# Altium project Power_Management_Unit.PrjPcb
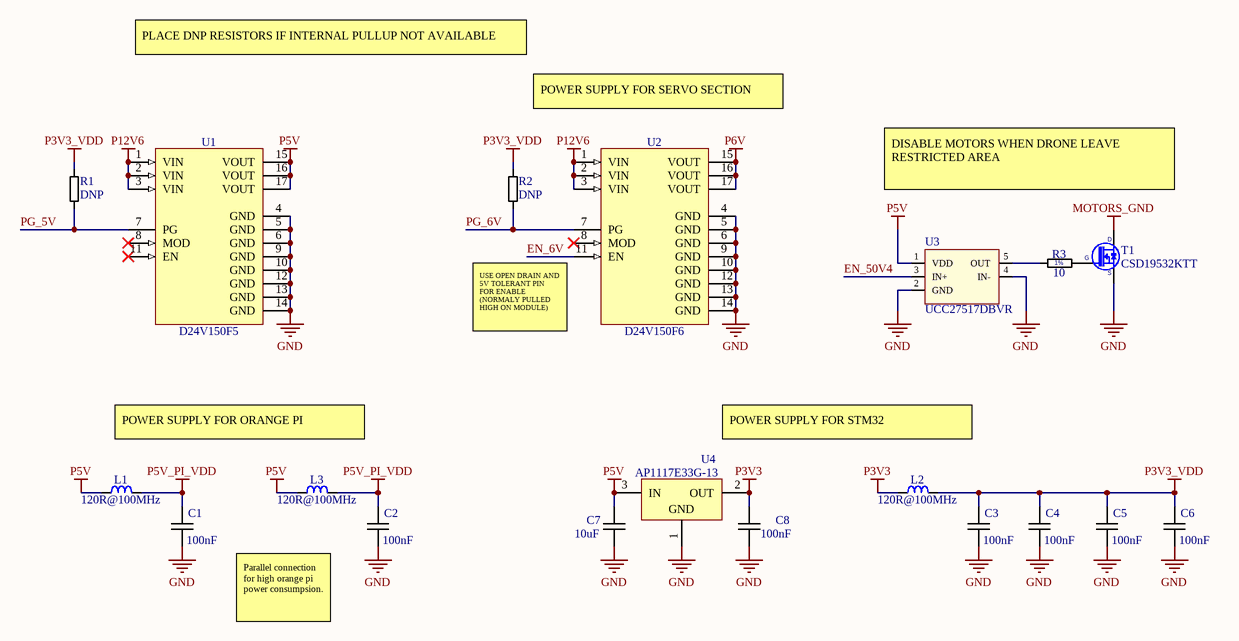
[diagram p0: Power.SchDoc]
5 sheets, 81 parts. Net scope: global (net labels, ports and power ports of the same name join across sheets).
Board file: PMU_v1.0.PcbDoc
Sheets:
  Power.SchDoc
  MCU.SchDoc
  Sensing.SchDoc
  Connectors.SchDoc
  Mechanical.SchDoc

## Sheet Power.SchDoc
size A4; CompanyName: TechOcean Sp. z o. o.; Address1: 02-639 Warszawa; Address2: Domaniewska 37A/119; Revision: 1.0; SheetNumber: 1; SheetTotal: 5

### Parts
C1  100nF  [CAPC0603X90N]
C2  100nF  [CAPC0603X90N]
C3  100nF  [CAPC0603X90N]
C4  100nF  [CAPC0603X90N]
C5  100nF  [CAPC0603X90N]
C6  100nF  [CAPC0603X90N]
C7  10uF  [CAPC0603X90N]
C8  100nF  [CAPC0603X90N]
L1  120R@100MHz  [INDC0603X90N]
L2  120R@100MHz  [INDC0603X90N]
L3  120R@100MHz  [INDC0603X90N]
R1  DNP  [RESC0603X60N]
R2  DNP  [RESC0603X60N]
R3  10  [RESC0603X60N]
T1  CSD19532KTT  [TO263-2]
U1  D24V150F5  [D24V150Fx]
U2  D24V150F6  [D24V150Fx]
U3  UCC27517DBVR  [SOT23-5]
U4  AP1117E33G-13  [SOT223]

### Nets
GND: C1.1 C2.1 C3.1 C4.1 C5.1 C6.1 C7.1 C8.1 T1.2(S) U1.4(GND) U1.5(GND) U1.6(GND) U1.9(GND) U1.10(GND) U1.12(GND) U1.13(GND) U1.14(GND) U2.4(GND) U2.5(GND) U2.6(GND) U2.9(GND) U2.10(GND) U2.12(GND) U2.13(GND) U2.14(GND) U3.2(GND) U3.4(IN-) U4.1(GND)
MOTORS_GND: T1.3(D)
P3V3: C8.2 L2.1 U4.2(OUT)
P3V3_VDD: C3.2 C4.2 C5.2 C6.2 L2.2 R1.2 R2.2
P5V: C7.2 L1.1 L3.1 U1.15(VOUT) U1.16(VOUT) U1.17(VOUT) U3.1(VDD) U4.3(IN)
P5V_PI_VDD: C1.2 C2.2 L1.2 L3.2
P6V: U2.15(VOUT) U2.16(VOUT) U2.17(VOUT)
P12V6: U1.1(VIN) U1.2(VIN) U1.3(VIN) U2.1(VIN) U2.2(VIN) U2.3(VIN)
EN_6V: U2.11(EN)
EN_50V4: U3.3(IN+)
PG_5V: R1.1 U1.7(PG)
PG_6V: R2.1 U2.7(PG)
NetR3_1: R3.1 U3.5(OUT)
NetR3_2: R3.2 T1.1(G)

Not connected (* = marked no-connect by the designer): U1 8(MOD)* 11(EN)*; U2 8(MOD)*

### Notes on the sheet
- PLACE DNP RESISTORS IF INTERNAL PULLUP NOT AVAILABLE
- POWER SUPPLY FOR SERVO SECTION
- DISABLE MOTORS WHEN DRONE LEAVE RESTRICTED AREA
- (near U2) USE OPEN DRAIN AND 5V TOLERANT PIN FOR ENABLE (NORMALY PULLED HIGH ON MODULE)
- POWER SUPPLY FOR ORANGE PI
- POWER SUPPLY FOR STM32
- Parallel connection for high orange pi power consumpsion.
- Project:
- Variant:
- File:
- Sheet:
- Revision:
- Total Sheet:
- Politechnika Warszawska
- Wydział Elektryczny
- Pl. Politechniki 1
- Author:
- Piotr Czapnik
- Modified:
- 00-661 Warszawa

### Library data of the parts
C1-C6 C8 = CC0603_100NF_16V_10%_X7R: Non-polarised capacitor; Manufacturer: GENERIC; Manufacturer 1 Example: Vishay; Manufacturer 1 Part Number: VJ0603Y104KXJCW1BC; Manufacturer 1 Component Height: 0.8mm; PressFit: No; Dielectric: X7R; Tolerance: 10%; Voltage: 16V; DesignItemId: CC0603_100NF_16V_10%_X7R; Author: KB; Case: 0603 (1608 metric); Component Kind: Standard; HelpURL: https://www.vishay.com/docs/28548/vjw1bcbascomseries.pdf; Manufacturer Part Number: CC0603_100NF_16V_10%_X7R; Mounted: Yes; Part Description: Non-polarised capacitor; Pin Count: 2; Sense: No; SMD: Yes; Socket: No; Status: Recommended; Value: 100nF; Supplier 1: Farnell; Supplier 2: TME; Supplier 3: Mouser; Create Date: 01.04.2019; LatestRevisionDate: 01.04.2019; Supplier Part Number 1: 2896425; Supplier Part Number 2: VJ0603Y104KXJCW1BC; Supplier Part Number 3: 710-885012206046
C7 = CC0603_10UF_16V_20%_X5R: Non-polarised capacitor; Manufacturer: GENERIC; Manufacturer 1 Example: Samsung; Manufacturer 1 Part Number: CL10A106MO8NQNC; Manufacturer 1 Component Height: 0.8mm; PressFit: No; Dielectric: X5R; Tolerance: 20%; Voltage: 16V; DesignItemId: CC0603_10UF_16V_20%_X5R; Author: KB; Case: 0603 (1608 metric); Component Kind: Standard; HelpURL: https://www.vishay.com/docs/28548/vjw1bcbascomseries.pdf; Manufacturer Part Number: CC0603_10UF_16V_20%_X5R; Mounted: Yes; Part Description: Non-polarised capacitor; Pin Count: 2; Sense: No; SMD: Yes; Socket: No; Status: Recommended; Value: 10uF; Supplier 1: Farnell; Supplier 2: TME; Supplier 3: Mouser; Create Date: 01.04.2019; LatestRevisionDate: 01.04.2019; Supplier Part Number 1: 2611923; Supplier Part Number 2: CL10A106MO8NQNC; Supplier Part Number 3: 81-GRM188R61C106KALD
L1-L3 = FB0603_120R@100MHZ_2A: Ferrite Bead; Manufacturer: GENERIC; Manufacturer 1 Example: Murata; Manufacturer 1 Part Number: BLM18PG121SN1D; Manufacturer 1 Component Height: 0.8mm; PressFit: No; Tolerance: 25%; DesignItemId: FB0603_120R@100MHZ_2A; Author: KB; Case: 0603 (1608 metric); Component Kind: Standard; HelpURL: https://www.tme.eu/Document/19a35c43258593752611d1c31a7dbf1a/MURATA-BLM18P.pdf; Manufacturer Part Number: FB0603_120R@100MHZ_2A; Mounted: Yes; Part Description: Ferrite Bead; Pin Count: 2; Sense: No; SMD: Yes; Socket: No; Status: Recommended; Value: 120R@100MHz; Supplier 1: Farnell; Supplier 2: TME; Supplier 3: Mouser; Create Date: 01.04.2019; LatestRevisionDate: 01.04.2019; Supplier Part Number 1: 1515738; Supplier Part Number 2: BLM18PG121SN1D; Supplier Part Number 3: 81-BLM18PG121SN1D
R1 R2 = R0603_DNP: General Purpose Thick Film Chip Resistor; Manufacturer: GENERIC; Manufacturer 1 Component Height: 0.5mm; Mounted: No; Current Max: 2; PressFit: No; Voltage: 75V; DesignItemId: R0603_DNP; Author: KB; Case: 0603 (1608 metric); Component Kind: Standard; Component Type: Standard; HelpURL: https://www.vishay.com/docs/20035/dcrcwe3.pdf; Manufacturer Part Number: DNP; Part Description: General Purpose Thick Film Chip Resistor; Pin Count: 2; Power: -; Sense: No; SMD: Yes; Socket: No; Status: Recommended; TC: -; Value: DNP; Create Date: 03.07.2019; LatestRevisionDate: 03.07.2019
R3 = R0603_10R0_0.1W_100PPM: General Purpose Thick Film Chip Resistor; Manufacturer: GENERIC; Manufacturer Part Number: R0603_10R0_0.0625W 0.1W 0.125W 0.25W 0.5W 1W 0.75W 1W_100PPM; Manufacturer 1 Example: Vishay; Manufacturer 1 Part Number: CRCW060310R0FKEDC; Manufacturer 1 Component Height: 0.5mm; Power: 100mW; Current Max: 0; PressFit: No; TC: ?100 ppm/?C; Tolerance: 1%; Voltage: 75V; DesignItemId: R0603_10R0_0.1W_100PPM; Author: KB; Case: 0603 (1608 metric); Component Kind: Standard; Component Type: Standard; HelpURL: https://www.vishay.com/docs/20035/dcrcwe3.pdf; Mounted: Yes; Part Description: General Purpose Thick Film Chip Resistor; Pin Count: 2; Sense: No; SMD: Yes; Socket: No; Status: Recommended; Value: 10; Supplier 1: Farnell; Supplier 2: TME; Supplier 3: Mouser; Create Date: 03.07.2019; LatestRevisionDate: 03.07.2019
T1 = CSD19532KTT: N-MOS 100V 98A 4.6mOhm; Manufacturer 1 Example: Texas Instruments; Manufacturer 1 Component Height: 4.6mm; PressFit: No; DesignItemId: CSD19532KTT; Author: PC; Device: CSD19532KTT; Component Kind: Standard; HelpURL: http://www.ti.com/lit/ds/symlink/csd19532ktt.pdf; Manufacturer 1 Part Number: CSD19532KTT; Mounted: Yes; Part Description: N-MOS 100V 98A 4.6mOhm; Pin Count: 2; Sense: No; SMD: Yes; Socket: No; Supplier 1: TME; Supplier 2: Mouser; Supplier 3: Digi-Key; Create Date: 03.03.2019; LatestRevisionDate: 03.03.2019; Supplier Part Number 1: CSD19532KTTT; Supplier Part Number 3: 296-CSD19532KTTCT-ND
U1 = D24V150F5: DC-DC Step-Down, IN: 6...40V, OUT: 5V; Manufacturer 1 Example: POLOLU; Manufacturer 1 Component Height: 11.37mm; PressFit: No; DesignItemId: D24V150F5; Author: PC; Device: D24V150F5; Component Kind: Standard; HelpURL: https://www.pololu.com/product/2881; Manufacturer 1 Part Number: D24V150F5; Mounted: Yes; Part Description: DC-DC Step-Down, IN: 6...40V, OUT: 5V; Pin Count: 17; Sense: No; SMD: No; Socket: No; Supplier 1: TME; Supplier 2: Botland; Supplier 3: Kamami; Create Date: 10.03.2020; LatestRevisionDate: 10.03.2020; Supplier Part Number 1: POLOLU-2881; Supplier Part Number 3: 563205
U2 = D24V150F6: DC-DC Step-Down, IN: 7.2...40V, OUT: 6V; Manufacturer 1 Example: POLOLU; Manufacturer 1 Component Height: 11.37mm; PressFit: No; DesignItemId: D24V150F6; Author: PC; Device: D24V150F6; Component Kind: Standard; HelpURL: https://www.pololu.com/product/2882; Manufacturer 1 Part Number: D24V150F6; Mounted: Yes; Part Description: DC-DC Step-Down, IN: 7.2...40V, OUT: 6V; Pin Count: 17; Sense: No; SMD: No; Socket: No; Supplier 1: TME; Supplier 2: Botland; Supplier 3: Kamami; Create Date: 10.03.2020; LatestRevisionDate: 10.03.2020; Supplier Part Number 1: POLOLU-2882; Supplier Part Number 3: 563591
U3 = UCC27517DBVR: FET Single Gate Driver IC; Manufacturer 1 Example: Texas Instruments; Manufacturer 1 Component Height: 1.45mm; PressFit: No; ComponentLink1Description: datasheet; ComponentLink1URL: x; Supplier 1: Mouser; Manufacturer 1: *; Supplier Part Number 1: 595-UCC27517DBVR; Manufacturer Part Number 1: *; DesignItemId: UCC27517DBVR; Author: BS; Device: UCC27517DBVR; Component Kind: Standard; HelpURL: http://www.ti.com/lit/ds/symlink/ucc27517.pdf; Manufacturer 1 Part Number: UCC27517DBVR; Mounted: Yes; Part Description: FET Single Gate Driver IC; Pin Count: 5; Sense: No; SMD: Yes; Socket: No; Supplier 2: Farnell; Create Date: 03.12.2019; LatestRevisionDate: 03.12.2019; Supplier Part Number 2: 3005801
U4 = AP1117E33G-13: 1A Low dropout positive P3V3 regulator; Manufacturer 1 Example: Diodes Incorporated; Manufacturer 1 Component Height: 1.75mm; PressFit: No; DesignItemId: AP1117E33G-13; Author: JK; Device: AP1117E33G-13; Component Kind: Standard; HelpURL: https://www.tme.eu/Document/601a4b72f2e6cfc100b2c2e81e705fa8/ap1117.pdf; Manufacturer 1 Part Number: AP1117E33G-13; Mounted: Yes; Part Description: 1A Low dropout positive P3V3 regulator; Pin Count: 3; Sense: No; SMD: Yes; Socket: No; Supplier 1: TME; Supplier 2: Farnell; Supplier 3: Mouser; Create Date: 05.09.2019; LatestRevisionDate: 05.09.2019; Supplier Part Number 1: AP1117E33G-13; Supplier Part Number 2: 1825291; Supplier Part Number 3: 621-AP1117E33G-13

## Sheet MCU.SchDoc
size A4; CompanyName: TechOcean Sp. z o. o.; Address1: 02-639 Warszawa; Address2: Domaniewska 37A/119; Revision: 1.0; SheetNumber: 2; SheetTotal: 5
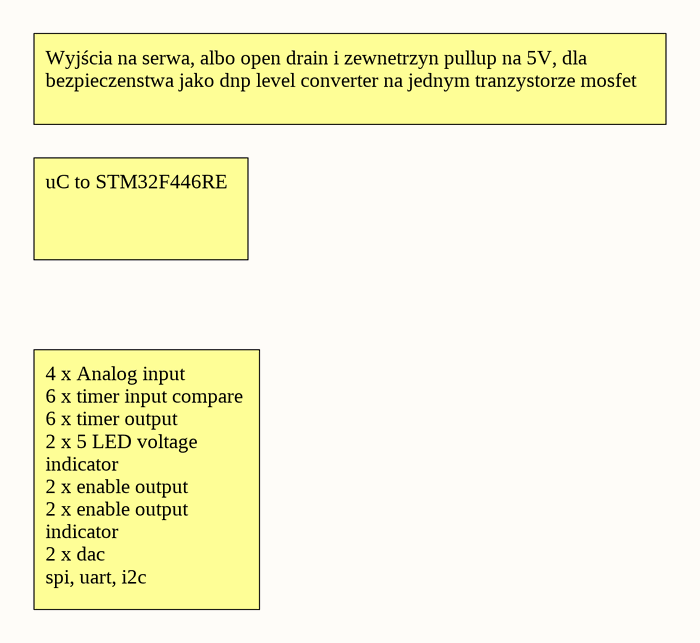
[diagram p1: MCU.SchDoc]

### Notes on the sheet
- Wyjścia na serwa, albo open drain i zewnetrzyn pullup na 5V, dla bezpieczenstwa jako dnp level converter na jednym tranzystorze mosfet
- uC to STM32F446RE
- 4 x Analog input            6 x timer input compare 6 x timer output             2 x 5 LED voltage indicator                        2 x enable output            2 x enable output indicator                         2 x dac                         spi, uart, i2c
- Project:
- Variant:
- File:
- Sheet:
- Revision:
- Total Sheet:
- Politechnika Warszawska
- Wydział Elektryczny
- Pl. Politechniki 1
- Author:
- Piotr Czapnik
- Modified:
- 00-661 Warszawa

## Sheet Sensing.SchDoc
size A4; Revision: 1.0; SheetNumber: 3; SheetTotal: 5
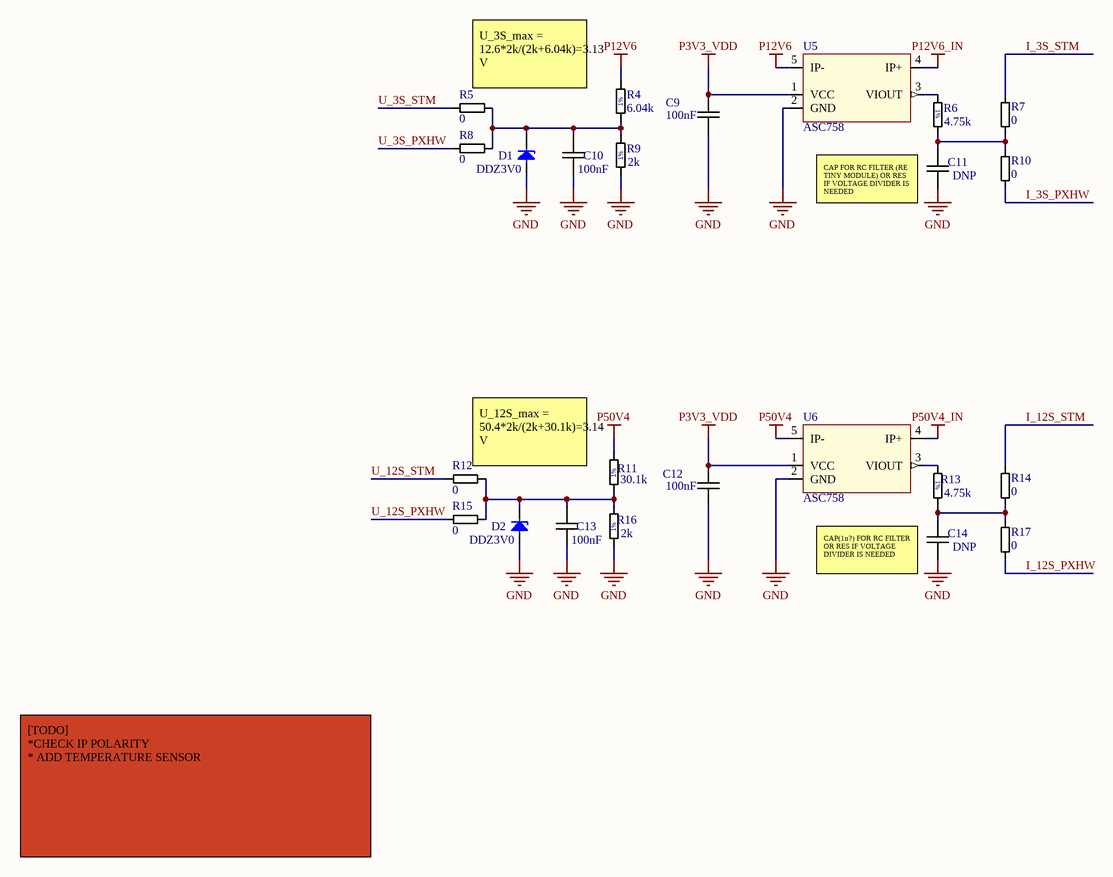
[diagram p2: Sensing.SchDoc]

### Parts
C9  100nF  [CAPC0603X90N]
C10  100nF  [CAPC0603X90N]
C11  DNP  [CAPC0603X90N]
C12  100nF  [CAPC0603X90N]
C13  100nF  [CAPC0603X90N]
C14  DNP  [CAPC0603X90N]
D1  DDZ3V0  [SOD323F-ZENER]
D2  DDZ3V0  [SOD323F-ZENER]
R4  6.04k  [RESC0603X60N]
R5  0  [RESC0603X60N]
R6  4.75k  [RESC0603X60N]
R7  0  [RESC0603X60N]
R8  0  [RESC0603X60N]
R9  2k  [RESC0603X60N]
R10  0  [RESC0603X60N]
R11  30.1k  [RESC0603X60N]
R12  0  [RESC0603X60N]
R13  4.75k  [RESC0603X60N]
R14  0  [RESC0603X60N]
R15  0  [RESC0603X60N]
R16  2k  [RESC0603X60N]
R17  0  [RESC0603X60N]
U5  ASC758  [PFF]
U6  ASC758  [PFF]

### Nets
GND: C9.1 C10.1 C11.1 C12.1 C13.1 C14.1 D1.2(A) D2.2(A) R9.1 R16.1 U5.2(GND) U6.2(GND)
P3V3_VDD: C9.2 C12.2 U5.1(VCC) U6.1(VCC)
P12V6: R4.2 U5.5(IP-)
P12V6_IN: U5.4(IP+)
P50V4: R11.2 U6.5(IP-)
P50V4_IN: U6.4(IP+)
I_3S_PXHW: R10.1
I_3S_STM: R7.2
I_12S_PXHW: R17.1
I_12S_STM: R14.2
U_3S_PXHW: R8.2
U_3S_STM: R5.2
U_12S_PXHW: R15.2
U_12S_STM: R12.2
NetC10_2: C10.2 D1.1(C) R4.1 R5.1 R8.1 R9.2
NetC11_2: C11.2 R6.2 R7.1 R10.2
NetC13_2: C13.2 D2.1(C) R11.1 R12.1 R15.1 R16.2
NetC14_2: C14.2 R13.2 R14.1 R17.2
NetR6_1: R6.1 U5.3(VIOUT)
NetR13_1: R13.1 U6.3(VIOUT)

### Notes on the sheet
- U_3S_max = 12.6*2k/(2k+6.04k)=3.13 V
- (near C11) CAP FOR RC FILTER (RE TINY MODULE) OR RES IF VOLTAGE DIVIDER IS NEEDED
- (near R12) U_12S_max = 50.4*2k/(2k+30.1k)=3.14 V
- (near C14) CAP(1n?) FOR RC FILTER OR RES IF VOLTAGE DIVIDER IS NEEDED
- [TODO]                                                                                                 *CHECK IP POLARITY                                                                      * ADD TEMPERATURE SENSOR
- Project:
- Variant:
- File:
- Sheet:
- Revision:
- Total Sheet:
- Politechnika Warszawska
- Wydział Elektryczny
- Pl. Politechniki 1
- Author:
- Piotr Czapnik
- Modified:
- 00-661 Warszawa

### Library data of the parts
C9 C10 C12 C13 = CC0603_100NF_16V_10%_X7R: as C1 on sheet Power; DesignItemId: CC0603_100NF_16V_10%_X7R; Author: KB; Case: 0603 (1608 metric); Component Kind: Standard; HelpURL: https://www.vishay.com/docs/28548/vjw1bcbascomseries.pdf; Manufacturer Part Number: CC0603_100NF_16V_10%_X7R; Mounted: Yes; Part Description: Non-polarised capacitor; Pin Count: 2; Sense: No; SMD: Yes; Socket: No; Status: Recommended; Value: 100nF; Supplier 1: Farnell; Supplier 2: TME; Supplier 3: Mouser; Create Date: 01.04.2019; LatestRevisionDate: 01.04.2019; Supplier Part Number 1: 2896425; Supplier Part Number 2: VJ0603Y104KXJCW1BC; Supplier Part Number 3: 710-885012206046
C11 C14 = CC0603_DNP: Non-polarised capacitor; Manufacturer: GENERIC; Manufacturer Part Number: UNDEFINED; Manufacturer 1 Component Height: 0.8mm; Mounted: No; PressFit: No; DesignItemId: CC0603_DNP; Author: KB; Case: 0603 (1608 metric); Component Kind: Standard; Part Description: Non-polarised capacitor; Pin Count: 2; Sense: No; SMD: Yes; Socket: No; Status: Recommended; Value: DNP; Create Date: 01.04.2019; LatestRevisionDate: 01.04.2019
D1 D2 = DDZ3V0BSF-7: Diode Zener, Uz 3.12V, 500mW; Manufacturer 1 Example: Diodes Incorporated; Manufacturer 1 Component Height: 0.7mm; PressFit: No; DesignItemId: DDZ3V0BSF-7; Author: PC; Device: DDZ3V0; Component Kind: Standard; Footprint: SOD323F; HelpURL: https://www.diodes.com/assets/Datasheets/ds31987.pdf; Manufacturer 1 Part Number: DDZ3V0BSF-7; Mounted: Yes; Part Description: Diode Zener, Uz 3.12V, 500mW; Pin Count: 2; Sense: No; SMD: Yes; Socket: No; Supplier 1: Mouser; Supplier 2: Digi-Key; Create Date: 18.03.2020; LatestRevisionDate: 18.03.2020; Supplier Part Number 2: DDZ3V0BSF-7DICT-ND; Supplier Part Number 1: 621-DDZ3V0BSF-7
R4 = R0603_6K04_0.1W_100PPM: General Purpose Thick Film Chip Resistor; Manufacturer: GENERIC; Manufacturer Part Number: R0603_6K04_0.0625W 0.1W 0.125W 0.25W 0.5W 1W 0.75W 1W_100PPM; Manufacturer 1 Example: Vishay; Manufacturer 1 Part Number: CRCW06036K04FKEDC; Manufacturer 1 Component Height: 0.5mm; Power: 100mW; Current Max: 0; PressFit: No; TC: ?100 ppm/?C; Tolerance: 1%; Voltage: 75V; DesignItemId: R0603_6K04_0.1W_100PPM; Author: KB; Case: 0603 (1608 metric); Component Kind: Standard; Component Type: Standard; HelpURL: https://www.vishay.com/docs/20035/dcrcwe3.pdf; Mounted: Yes; Part Description: General Purpose Thick Film Chip Resistor; Pin Count: 2; Sense: No; SMD: Yes; Socket: No; Status: Recommended; Value: 6.04k; Supplier 1: Farnell; Supplier 2: TME; Supplier 3: Mouser; Create Date: 03.07.2019; LatestRevisionDate: 03.07.2019
R5 R7 R8 R10 R12 R14 R15 R17 = R0603_0R_JUMPER: General Purpose Thick Film Chip Resistor; Manufacturer: GENERIC; Manufacturer 1 Example: Vishay; Manufacturer 1 Part Number: CRCW06030000Z0EDC; Manufacturer 1 Component Height: 0.5mm; Current Max: 2; PressFit: No; Tolerance: 20mOhm; Voltage: 75V; DesignItemId: R0603_0R_JUMPER; Author: KB; Case: 0603 (1608 metric); Component Kind: Standard; Component Type: Standard; HelpURL: https://www.vishay.com/docs/20035/dcrcwe3.pdf; Manufacturer Part Number: R0603_0R_JUMPER; Mounted: Yes; Part Description: General Purpose Thick Film Chip Resistor; Pin Count: 2; Power: -; Sense: No; SMD: Yes; Socket: No; Status: Recommended; TC: -; Value: 0; Supplier 1: Farnell; Supplier 2: TME; Supplier 3: Mouser; Create Date: 03.07.2019; LatestRevisionDate: 03.07.2019; Supplier Part Number 3: 71-CRCW06030000Z0EAC; Supplier Part Number 2: CRCW06030000Z0TABC; Supplier Part Number 1: 2616741
R6 R13 = R0603_4K75_0.1W_100PPM: General Purpose Thick Film Chip Resistor; Manufacturer: GENERIC; Manufacturer Part Number: R0603_4K75_0.0625W 0.1W 0.125W 0.25W 0.5W 1W 0.75W 1W_100PPM; Manufacturer 1 Example: Vishay; Manufacturer 1 Part Number: CRCW06034K75FKEDC; Manufacturer 1 Component Height: 0.5mm; Power: 100mW; Current Max: 0; PressFit: No; TC: ?100 ppm/?C; Tolerance: 1%; Voltage: 75V; DesignItemId: R0603_4K75_0.1W_100PPM; Author: KB; Case: 0603 (1608 metric); Component Kind: Standard; Component Type: Standard; HelpURL: https://www.vishay.com/docs/20035/dcrcwe3.pdf; Mounted: Yes; Part Description: General Purpose Thick Film Chip Resistor; Pin Count: 2; Sense: No; SMD: Yes; Socket: No; Status: Recommended; Value: 4.75k; Supplier 1: Farnell; Supplier 2: TME; Supplier 3: Mouser; Create Date: 03.07.2019; LatestRevisionDate: 03.07.2019
R9 R16 = R0603_2K00_0.1W_100PPM: General Purpose Thick Film Chip Resistor; Manufacturer: GENERIC; Manufacturer Part Number: R0603_2K00_0.0625W 0.1W 0.125W 0.25W 0.5W 1W 0.75W 1W_100PPM; Manufacturer 1 Example: Vishay; Manufacturer 1 Part Number: CRCW06032K00FKEDC; Manufacturer 1 Component Height: 0.5mm; Power: 100mW; Current Max: 0; PressFit: No; TC: ?100 ppm/?C; Tolerance: 1%; Voltage: 75V; DesignItemId: R0603_2K00_0.1W_100PPM; Author: KB; Case: 0603 (1608 metric); Component Kind: Standard; Component Type: Standard; HelpURL: https://www.vishay.com/docs/20035/dcrcwe3.pdf; Mounted: Yes; Part Description: General Purpose Thick Film Chip Resistor; Pin Count: 2; Sense: No; SMD: Yes; Socket: No; Status: Recommended; Value: 2k; Supplier 1: Farnell; Supplier 2: TME; Supplier 3: Mouser; Create Date: 03.07.2019; LatestRevisionDate: 03.07.2019
R11 = R0603_30K1_0.1W_100PPM: General Purpose Thick Film Chip Resistor; Manufacturer: GENERIC; Manufacturer Part Number: R0603_30K1_0.0625W 0.1W 0.125W 0.25W 0.5W 1W 0.75W 1W_100PPM; Manufacturer 1 Example: Vishay; Manufacturer 1 Part Number: CRCW060330K1FKEDC; Manufacturer 1 Component Height: 0.5mm; Power: 100mW; Current Max: 0; PressFit: No; TC: ?100 ppm/?C; Tolerance: 1%; Voltage: 75V; DesignItemId: R0603_30K1_0.1W_100PPM; Author: KB; Case: 0603 (1608 metric); Component Kind: Standard; Component Type: Standard; HelpURL: https://www.vishay.com/docs/20035/dcrcwe3.pdf; Mounted: Yes; Part Description: General Purpose Thick Film Chip Resistor; Pin Count: 2; Sense: No; SMD: Yes; Socket: No; Status: Recommended; Value: 30.1k; Supplier 1: Farnell; Supplier 2: TME; Supplier 3: Mouser; Create Date: 03.07.2019; LatestRevisionDate: 03.07.2019
U5 U6 = ASC758: Hall-Effect-Based / Linear Current Sensor IC with 100 µ? Current Conductor; Manufacturer 1 Example: Allegro; Manufacturer 1 Part Number: ACS758ECB-200B-PFF-T; Manufacturer 1 Component Height: 7mm; PressFit: No; DesignItemId: ASC758; Author: PC; Device: ASC758; Component Kind: Standard; Footprint: Allegro custom CA/CB; HelpURL: http://elty.pl/upload/download/ACS758-Datasheet.pdf; Mounted: Yes; Part Description: Hall-Effect-Based / Linear Current Sensor IC with 100 µ? Current Conductor; Pin Count: 5; Sense: Yes; SMD: No; Socket: No; Supplier 1: Farnell; Supplier 2: Digi-Key; Create Date: 10.03.2020; LatestRevisionDate: 10.03.2020; Supplier Part Number 1: 1791391; Supplier Part Number 2: 620-1323-ND

## Sheet Connectors.SchDoc
size A4; Revision: 1.0; SheetNumber: 4; SheetTotal: 5
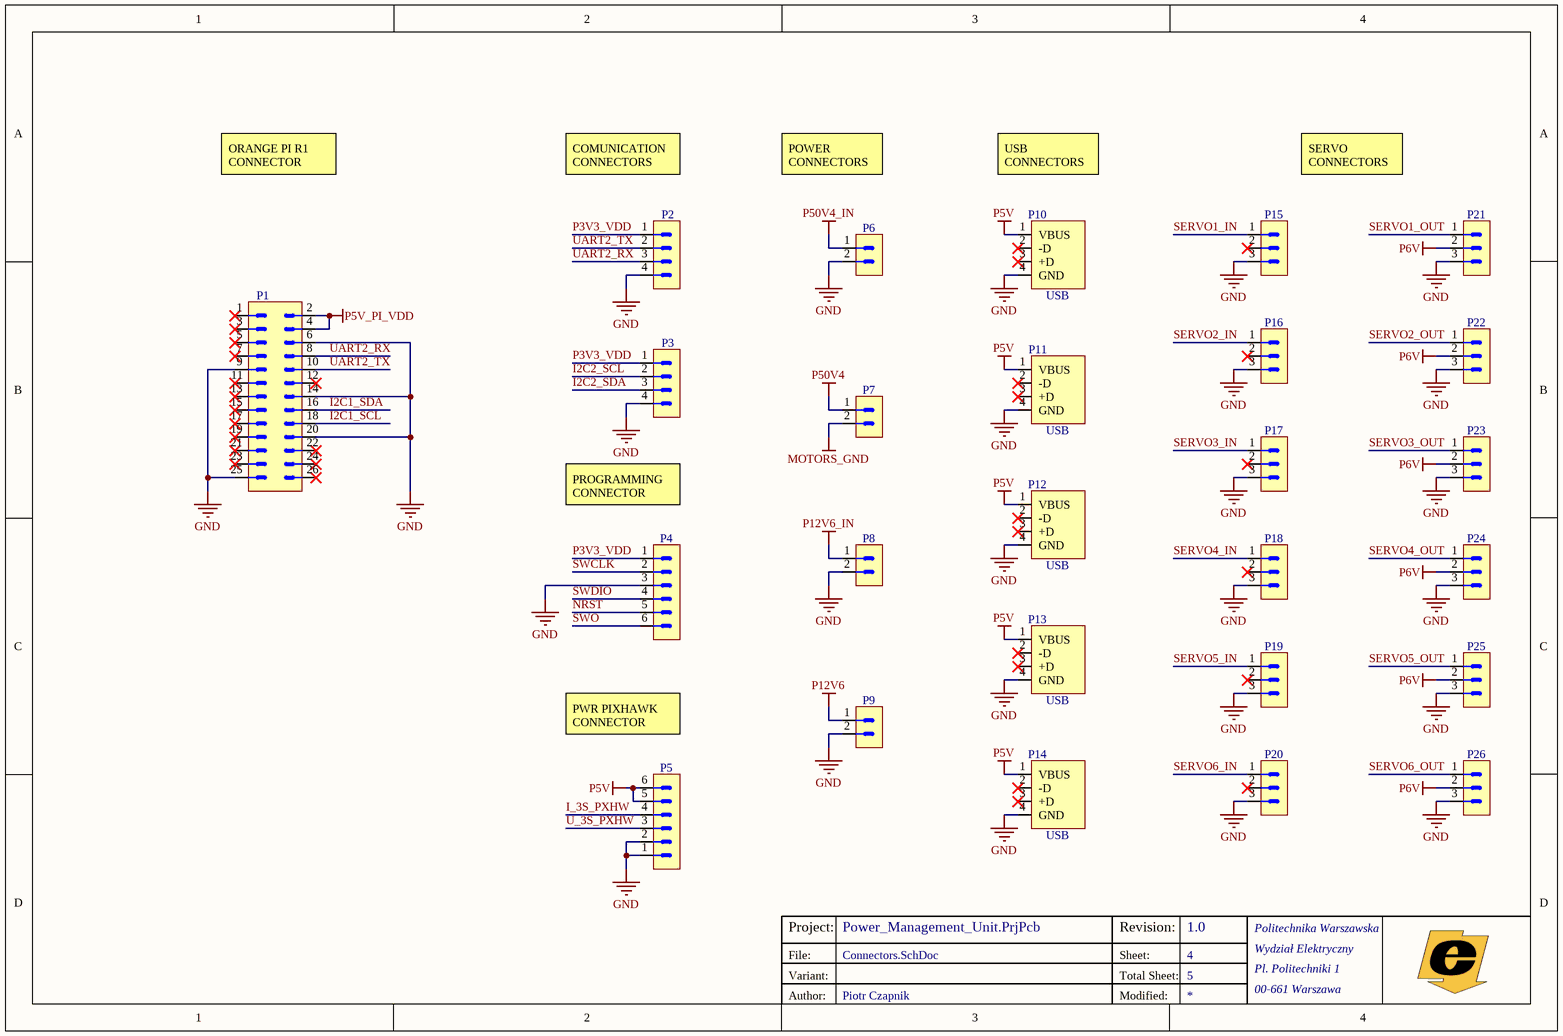
[diagram p3: Connectors.SchDoc]

### Parts
P1  SAMTEC_SSW-113-02-G-D  [SAMTEC_SSW-113-02-G-D]  (value not drawn)
P2  SAMTEC_TSW-104-07-G-S  [SAMTEC_TSW-104-07-G-S]  (value not drawn)
P3  (no value)  [BM04B-GHS-TBT]
P4  MTLW-106-07-L-S-250  [SAMTEC_MTLW-106-07-L-S-250]  (value not drawn)
P5  (no value)  [BM06B-GHS-TBT]
P6  XT60PW-M  [XT60PW-M]  (value not drawn)
P7  XT60PW-F  [XT60PW-F]  (value not drawn)
P8  XT60PW-M  [XT60PW-M]  (value not drawn)
P9  XT60PW-F  [XT60PW-F]  (value not drawn)
P10  USB  [USB-A-S-RA]
P11  USB  [USB-A-S-RA]
P12  USB  [USB-A-S-RA]
P13  USB  [USB-A-S-RA]
P14  USB  [USB-A-S-RA]
P15  826926-3  [Header_3x1_2.54mm_M]  (value not drawn)
P16  826926-3  [Header_3x1_2.54mm_M]  (value not drawn)
P17  826926-3  [Header_3x1_2.54mm_M]  (value not drawn)
P18  826926-3  [Header_3x1_2.54mm_M]  (value not drawn)
P19  826926-3  [Header_3x1_2.54mm_M]  (value not drawn)
P20  826926-3  [Header_3x1_2.54mm_M]  (value not drawn)
P21  826926-3  [Header_3x1_2.54mm_M]  (value not drawn)
P22  826926-3  [Header_3x1_2.54mm_M]  (value not drawn)
P23  826926-3  [Header_3x1_2.54mm_M]  (value not drawn)
P24  826926-3  [Header_3x1_2.54mm_M]  (value not drawn)
P25  826926-3  [Header_3x1_2.54mm_M]  (value not drawn)
P26  826926-3  [Header_3x1_2.54mm_M]  (value not drawn)

### Nets
GND: P1.6 P1.9 P1.14 P1.20 P1.25 P2.4 P3.4 P4.3 P5.1 P5.2 P6.2 P8.2 P9.2 P10.4(GND) P11.4(GND) P12.4(GND) P13.4(GND) P14.4(GND) P15.3 P16.3 P17.3 P18.3 P19.3 P20.3 P21.3 P22.3 P23.3 P24.3 P25.3 P26.3
MOTORS_GND: P7.2
P3V3_VDD: P2.1 P3.1 P4.1
P5V: P5.5 P5.6 P10.1(VBUS) P11.1(VBUS) P12.1(VBUS) P13.1(VBUS) P14.1(VBUS)
P5V_PI_VDD: P1.2 P1.4
P6V: P21.2 P22.2 P23.2 P24.2 P25.2 P26.2
P12V6: P9.1
P12V6_IN: P8.1
P50V4: P7.1
P50V4_IN: P6.1
I2C1_SCL: P1.18
I2C1_SDA: P1.16
I2C2_SCL: P3.2
I2C2_SDA: P3.3
I_3S_PXHW: P5.4
NRST: P4.5
SERVO1_IN: P15.1
SERVO1_OUT: P21.1
SERVO2_IN: P16.1
SERVO2_OUT: P22.1
SERVO3_IN: P17.1
SERVO3_OUT: P23.1
SERVO4_IN: P18.1
SERVO4_OUT: P24.1
SERVO5_IN: P19.1
SERVO5_OUT: P25.1
SERVO6_IN: P20.1
SERVO6_OUT: P26.1
SWCLK: P4.2
SWDIO: P4.4
SWO: P4.6
U_3S_PXHW: P5.3
UART2_RX: P1.8 P2.3
UART2_TX: P1.10 P2.2

Not connected (* = marked no-connect by the designer): P1 1* 3* 5* 7* 11(12)* 12* 13* 15* 17* 19* 21* 22* 23* 24* 26*; P10 2(-D)* 3(+D)*; P11 2(-D)* 3(+D)*; P12 2(-D)* 3(+D)*; P13 2(-D)* 3(+D)*; P14 2(-D)* 3(+D)*; P15 2*; P16 2*; P17 2*; P18 2*; P19 2*; P20 2*

### Notes on the sheet
- ORANGE PI R1 CONNECTOR
- COMUNICATION CONNECTORS
- POWER CONNECTORS
- USB CONNECTORS
- SERVO CONNECTORS
- PROGRAMMING CONNECTOR
- PWR PIXHAWK CONNECTOR
- Project:
- Variant:
- File:
- Sheet:
- Revision:
- Total Sheet:
- Politechnika Warszawska
- Wydział Elektryczny
- Pl. Politechniki 1
- Author:
- Piotr Czapnik
- Modified:
- 00-661 Warszawa

### Library data of the parts
P1 = HDR_THT_13X2V_F_2P54MM: General Purpose Header: THT, 2.54mm, Female, Straight; Manufacturer: GENERIC; Manufacturer 1 Example: Samtec; Manufacturer 1 Component Height: 8.5mm; Current Max: 4.7A; PressFit: No; DesignItemId: HDR_THT_13X2V_F_2P54MM; Author: PC; Family: SSW; Component Kind: Standard; HelpURL: https://pl.mouser.com/datasheet/2/527/ssw_th-1507658.pdf; Manufacturer Part Number: SAMTEC_SSW-113-02-G-D; Manufacturer 1 Part Number: SAMTEC_SSW-113-02-G-D; Mounted: Yes; Part Description: General Purpose Header: THT, 2.54mm, Female, Straight; Pin Count: 26; Sense: No; SMD: No; Socket: No; Status: Recommended; Supplier 1: Mouser; Create Date: 18.03.2020; LatestRevisionDate: 18.03.2020; Supplier Part Number 1: 200-SSW11302GD
P2 = HDR_THT_4X1V_M_2P54MM: General Purpose Header: THT, 2.54mm, Male, Straight; Manufacturer: GENERIC; Manufacturer 1 Example: Samtec; Manufacturer 1 Component Height: 8.5mm; PressFit: No; DesignItemId: HDR_THT_4X1V_M_2P54MM; Author: PC; Family: TSW; Component Kind: Standard; HelpURL: http://suddendocs.samtec.com/catalog_english/tsw_th.pdf; Manufacturer Part Number: SAMTEC_TSW-104-07-G-S; Manufacturer 1 Part Number: SAMTEC_TSW-104-07-G-S; Mounted: Yes; Part Description: General Purpose Header: THT, 2.54mm, Male, Straight; Pin Count: 4; Sense: No; SMD: No; Socket: No; Status: Recommended; Supplier 1: Mouser; Create Date: 18.03.2020; LatestRevisionDate: 18.03.2020; Supplier Part Number 1: 200-TSW10407GS
P3 = JST_GH_4PIN_V: JST GH series 4 pin vertical SMT connector, pitch 1.25mm, Right Angle; Manufacturer Part Number: BM04B-GHS-TBT (LF)(SN); Manufacturer 1 Component Height: 4.05mm; PressFit: No; DesignItemId: JST_GH_4PIN_V; Author: PC; Family: GH; Component Kind: Standard; HelpURL: http://www.farnell.com/datasheets/2082975.pdf?_ga=2.136648627.2050948970.1584303774-2014276691.1568213371; Manufacturer: JST; Mounted: Yes; Part Description: JST GH series 4 pin vertical SMT connector, pitch 1.25mm, Right Angle; Pin Count: 4; Sense: No; SMD: Yes; Socket: No; Status: Recommended; Supplier 1: Digi-Key; Supplier 2: Farnell; Create Date: 16.03.2020; LatestRevisionDate: 16.03.2020; Supplier Part Number 1: 455-1580-2-ND; Supplier Part Number 2: 1516208
P4 = HDR_THT_6X1V_M_2P54MM: General Purpose Header: THT, 2.54mm, Male, Straight; Manufacturer: GENERIC; Manufacturer 1 Example: Samtec; Manufacturer 1 Component Height: 10.92mm; Current Max: 5.2A; PressFit: No; DesignItemId: HDR_THT_6X1V_M_2P54MM; Author: PC; Family: MLTW; Component Kind: Standard; Footprint: HDR_6X1V_M_2P54MM; HelpURL: https://pl.mouser.com/datasheet/2/527/mtlw_th-1370324.pdf; Manufacturer Part Number: HDR_THT_6X1V_M_2P54MM; Manufacturer 1 Part Number: MTLW-106-07-L-S-250; Mounted: Yes; Part Description: General Purpose Header: THT, 2.54mm, Male, Straight; Pin Count: 6; Sense: No; SMD: No; Socket: No; Status: Recommended; Supplier 1: Mouser; Supplier 2: Digi-Key; Create Date: 19.08.2012; LatestRevisionDate: 19.08.2012; Supplier Part Number 1: 200-MTLW10607LS250
P5 = JST_GH_6PIN_V: JST GH series 6 pin vertical SMT connector, pitch 1.25mm, Right Angle; Manufacturer Part Number: BM06B-GHS-TBT (LF)(SN); Manufacturer 1 Component Height: 4.05mm; PressFit: No; DesignItemId: JST_GH_6PIN_V; Author: PC; Family: GH; Component Kind: Standard; HelpURL: http://www.farnell.com/datasheets/2082975.pdf?_ga=2.136648627.2050948970.1584303774-2014276691.1568213371; Manufacturer: JST; Mounted: Yes; Part Description: JST GH series 6 pin vertical SMT connector, pitch 1.25mm, Right Angle; Pin Count: 6; Sense: No; SMD: Yes; Socket: No; Status: Recommended; Supplier 1: Digi-Key; Supplier 2: rs-online; Create Date: 18.03.2020; LatestRevisionDate: 18.03.2020; Supplier Part Number 1: 455-1582-2-ND; Supplier Part Number 2: 752-1771
P6 P8 = XT60PW-M: XT60 male connector, right angle, 2 Positions, THT, 17.2x15.5mm body; Manufacturer: GENERIC; Manufacturer 1 Example: AMASS; Manufacturer 1 Component Height: 10.9mm; Current Max: 30A; PressFit: No; Voltage Max: 500V; DesignItemId: XT60PW-M; Author: PC; Family: XT60; Component Kind: Standard; HelpURL: https://www.tme.eu/Document/9b8d0c5eb7094295f3d3112c214d3ade/XT60PW%20SPEC.pdf; Manufacturer Part Number: XT60PW-M; Manufacturer 1 Part Number: XT60PW-M; Mounted: Yes; Part Description: XT60 male connector, right angle, 2 Positions, THT, 17.2x15.5mm body; Pin Count: 2; Sense: No; SMD: No; Socket: No; Status: Recommended; Supplier 1: TME; Create Date: 15.03.2020; LatestRevisionDate: 15.03.2020; Supplier Part Number 1: XT60PW-M
P7 P9 = XT60PW-F: XT60 female connector, right angle, 2 Positions, THT, 17.2x15.5mm body; Manufacturer: GENERIC; Manufacturer 1 Example: AMASS; Manufacturer 1 Component Height: 10.9mm; Current Max: 30A; PressFit: No; Voltage Max: 500V; DesignItemId: XT60PW-F; Author: PC; Family: XT60; Component Kind: Standard; HelpURL: https://www.tme.eu/Document/9b8d0c5eb7094295f3d3112c214d3ade/XT60PW%20SPEC.pdf; Manufacturer Part Number: XT60PW-F; Manufacturer 1 Part Number: XT60PW-F; Mounted: Yes; Part Description: XT60 female connector, right angle, 2 Positions, THT, 17.2x15.5mm body; Pin Count: 2; Sense: No; SMD: No; Socket: No; Status: Recommended; Supplier 1: TME; Create Date: 15.03.2020; LatestRevisionDate: 15.03.2020; Supplier Part Number 1: XT60PW-F
P10-P14 = USB-A: USB 2.0 Type A Female Connector 4-Pin THT; Manufacturer: GENERIC; Manufacturer 1 Example: ADAM TECH; Manufacturer 1 Component Height: 6.9mm; PressFit: No; DesignItemId: USB-A; Author: BS; Family: USB; Component Kind: Standard; HelpURL: https://www.tme.eu/Document/eeaaeff341ffd60fb24eb1a497f68654/826926-2.pdf; Manufacturer Part Number: USB-A-S-RA; Manufacturer 1 Part Number: USB-A-S-RA; Mounted: Yes; Part Description: USB 2.0 Type A Female Connector 4-Pin THT; Pin Count: 4; Sense: No; SMD: No; Socket: No; Status: Recommended; Supplier 1: TME; Create Date: 16.09.2019; LatestRevisionDate: 14.03.2019; Supplier Part Number 1: USB-A-S-RA
P15-P26 = HDR_THT_3X1V_M_2P54MM: General Purpose Header: THT, 2.54mm, Male, Straight; Manufacturer: GENERIC; Manufacturer 1 Example: TE Connectivity; Manufacturer 1 Component Height: 12.7mm; PressFit: No; DesignItemId: HDR_THT_3X1V_M_2P54MM; Author: JK; Family: AMPMODU MOD II; Component Kind: Standard; HelpURL: https://www.tme.eu/Document/eeaaeff341ffd60fb24eb1a497f68654/826926-2.pdf; Manufacturer Part Number: 826926-3; Manufacturer 1 Part Number: 826926-3; Mounted: Yes; Part Description: General Purpose Header: THT, 2.54mm, Male, Straight; Pin Count: 3; Sense: No; SMD: No; Socket: No; Status: Recommended; Supplier 1: TME; Supplier 2: Farnell; Supplier 3: Digi-Key; Create Date: 16.09.2019; LatestRevisionDate: 16.09.2019; Supplier Part Number 1: 826926-3; Supplier Part Number 2: 1248141; Supplier Part Number 3: A106483-ND

## Sheet Mechanical.SchDoc
size A4; CompanyName: TechOcean Sp. z o. o.; Address1: 02-639 Warszawa; Address2: Domaniewska 37A/119; Revision: 1.0; SheetNumber: 5; SheetTotal: 5
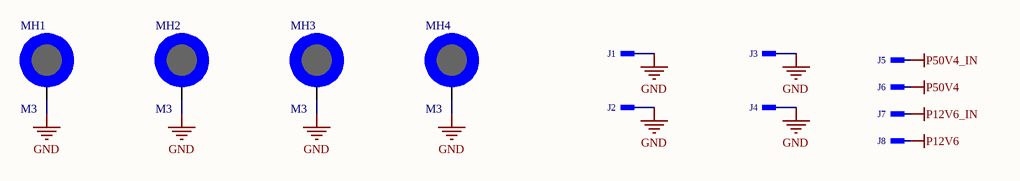
[diagram p4: Mechanical.SchDoc]

### Parts
J1  Pad  [PAD_SMD_S1200X500]  (value not drawn)  (no BOM)
J2  Pad  [PAD_SMD_S1200X500]  (value not drawn)  (no BOM)
J3  Pad  [PAD_SMD_S1200X500]  (value not drawn)  (no BOM)
J4  Pad  [PAD_SMD_S1200X500]  (value not drawn)  (no BOM)
J5  Pad  [PAD_SMD_S1200X500]  (value not drawn)  (no BOM)
J6  Pad  [PAD_SMD_S1200X500]  (value not drawn)  (no BOM)
J7  Pad  [PAD_SMD_S1200X500]  (value not drawn)  (no BOM)
J8  Pad  [PAD_SMD_S1200X500]  (value not drawn)  (no BOM)
MH1  M3  [MH-M3_COPPER_WASHER]  (no BOM)
MH2  M3  [MH-M3_COPPER_WASHER]  (no BOM)
MH3  M3  [MH-M3_COPPER_WASHER]  (no BOM)
MH4  M3  [MH-M3_COPPER_WASHER]  (no BOM)

### Nets
GND: J1.1 J2.1 J3.1 J4.1 MH1.MH MH2.MH MH3.MH MH4.MH
P12V6: J8.1
P12V6_IN: J7.1
P50V4: J6.1
P50V4_IN: J5.1

### Notes on the sheet
- Project:
- Variant:
- File:
- Sheet:
- Revision:
- Total Sheet:
- Politechnika Warszawska
- Wydział Elektryczny
- Pl. Politechniki 1
- Author:
- Piotr Czapnik
- Modified:
- 00-661 Warszawa

### Library data of the parts
J1-J8 = PAD_SMD_S1200X500: 12mm x  5mm SMD Pad with stitches; DesignItemId: PAD_SMD_S1200X500; Author: PC; Family: Pad; Part Description: 12mm x  5mm SMD Pad with stitches; Create Date: 14.03.2020; LatestRevisionDate: 14.03.2020
MH1-MH4 = MH-M3_CW: Mounting hole, M3, exposed pad, space for washer; DesignItemId: MH-M3_CW; Author: KB; Family: M3; Part Description: Mounting hole, M3, exposed pad, space for washer; Create Date: 19.05.2011; LatestRevisionDate: 19.05.2011

## Nets that join several sheets
GND: Power (28 pins), Sensing (12 pins), Connectors (30 pins), Mechanical (8 pins)
MOTORS_GND: Power (T1.3), Connectors (P7.2)
P3V3_VDD: Power (7 pins), Sensing (C9.2 C12.2 U5.1 U6.1), Connectors (P2.1 P3.1 P4.1)
P5V: Power (8 pins), Connectors (7 pins)
P5V_PI_VDD: Power (C1.2 C2.2 L1.2 L3.2), Connectors (P1.2 P1.4)
P6V: Power (U2.15 U2.16 U2.17), Connectors (6 pins)
P12V6: Power (6 pins), Sensing (R4.2 U5.5), Connectors (P9.1), Mechanical (J8.1)
P12V6_IN: Sensing (U5.4), Connectors (P8.1), Mechanical (J7.1)
P50V4: Sensing (R11.2 U6.5), Connectors (P7.1), Mechanical (J6.1)
P50V4_IN: Sensing (U6.4), Connectors (P6.1), Mechanical (J5.1)
I_3S_PXHW: Sensing (R10.1), Connectors (P5.4)
U_3S_PXHW: Sensing (R8.2), Connectors (P5.3)